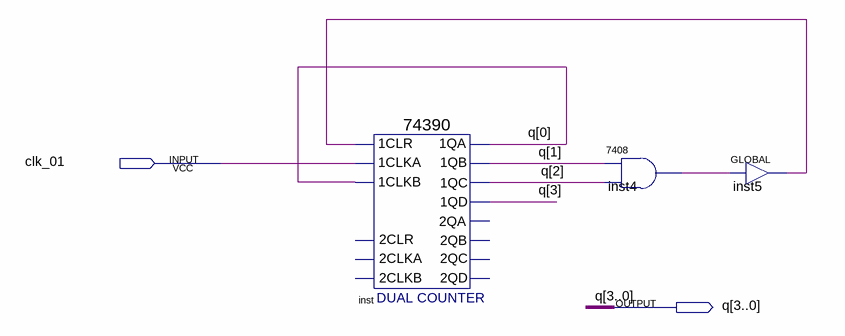
[diagram p0: schematic sheet]
// Quartus schematic cnt6.bdf as structural Verilog: 3 symbols, 2 pins
module cnt6 (
  input  clk_01,
  output [3:0] q
);

  wire inst4_1, inst5_out;

  \74390  inst (
    .\1CLR (inst5_out), .\1CLKA (clk_01), .\1CLKB (q[0]), .\1QA (q[0]), .\1QB (q[1]), .\1QC (q[2]),
    .\1QD (q[3]));  // open: 2CLKA, 2CLR, 2CLKB, 2QA, 2QB, 2QC, 2QD
  \7408  inst4 (.\3 (q[2]), .\2 (q[1]), .\1 (inst4_1));
  GLOBAL inst5 (.IN(inst4_1), .OUT(inst5_out));
endmodule
